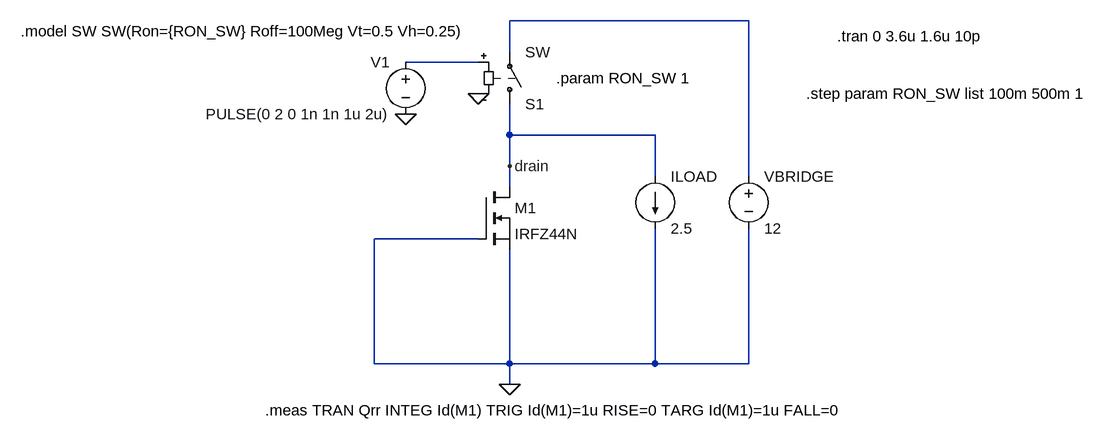
[diagram p0: schematic tb_rr_charge.asc]
tb_rr_charge.asc, the LTspice schematic file:
Version 4
SHEET 1 1272 680
WIRE 720 -160 352 -160
WIRE 352 -112 352 -160
WIRE 304 -96 192 -96
WIRE 352 16 352 -32
WIRE 576 16 352 16
WIRE 352 64 352 16
WIRE 576 80 576 16
WIRE 720 80 720 -160
WIRE 352 96 352 64
WIRE 304 176 144 176
WIRE 144 368 144 176
WIRE 352 368 352 192
WIRE 352 368 144 368
WIRE 576 368 576 160
WIRE 576 368 352 368
WIRE 720 368 720 160
WIRE 720 368 576 368
WIRE 352 400 352 368
FLAG 352 400 0
FLAG 352 64 drain
FLAG 304 -48 0
FLAG 192 -16 0
SYMBOL nmos 304 96 R0
SYMATTR InstName M1
SYMATTR Value IRFZ44N
SYMBOL sw 352 -16 M180
SYMATTR InstName S1
SYMBOL voltage 192 -112 M0
WINDOW 123 0 0 Left 0
WINDOW 39 0 0 Left 0
SYMATTR InstName V1
SYMATTR Value PULSE(0 2 0 1n 1n 1u 2u)
SYMBOL current 576 80 R0
WINDOW 123 0 0 Left 0
WINDOW 39 0 0 Left 0
SYMATTR InstName ILOAD
SYMATTR Value 2.5
SYMBOL voltage 720 64 R0
WINDOW 123 0 0 Left 0
WINDOW 39 0 0 Left 0
SYMATTR InstName VBRIDGE
SYMATTR Value 12
TEXT -400 -144 Left 2 !.model SW SW(Ron={RON_SW} Roff=100Meg Vt=0.5 Vh=0.25)
TEXT 856 -136 Left 2 !.tran 0 3.6u 1.6u 10p
TEXT -24 440 Left 2 !.meas TRAN Qrr INTEG Id(M1) TRIG Id(M1)=1u RISE=0 TARG Id(M1)=1u FALL=0
TEXT 424 -72 Left 2 !.param RON_SW 1
TEXT 808 -48 Left 2 !.step param RON_SW list 100m 500m 1

The netlist it stands for:
* tb_rr_charge.asc
M1 drain 0 0 0 IRFZ44N
S1 drain N001 N002 0 SW
V1 N002 0 PULSE(0 2 0 1n 1n 1u 2u)
ILOAD drain 0 2.5
VBRIDGE N001 0 12
.model NMOS NMOS
.model PMOS PMOS
.lib standard.mos
.model SW SW(Ron={RON_SW} Roff=100Meg Vt=0.5 Vh=0.25)
.tran 0 3.6u 1.6u 10p
.meas TRAN Qrr INTEG Id(M1) TRIG Id(M1)=1u RISE=0 TARG Id(M1)=1u FALL=0
.param RON_SW 1
.step param RON_SW list 100m 500m 1
.backanno
.end